# Altium schematic sheet LED_Matrix_Driver.SchDoc
size A3; SheetNumber: 4; SheetTotal: 4
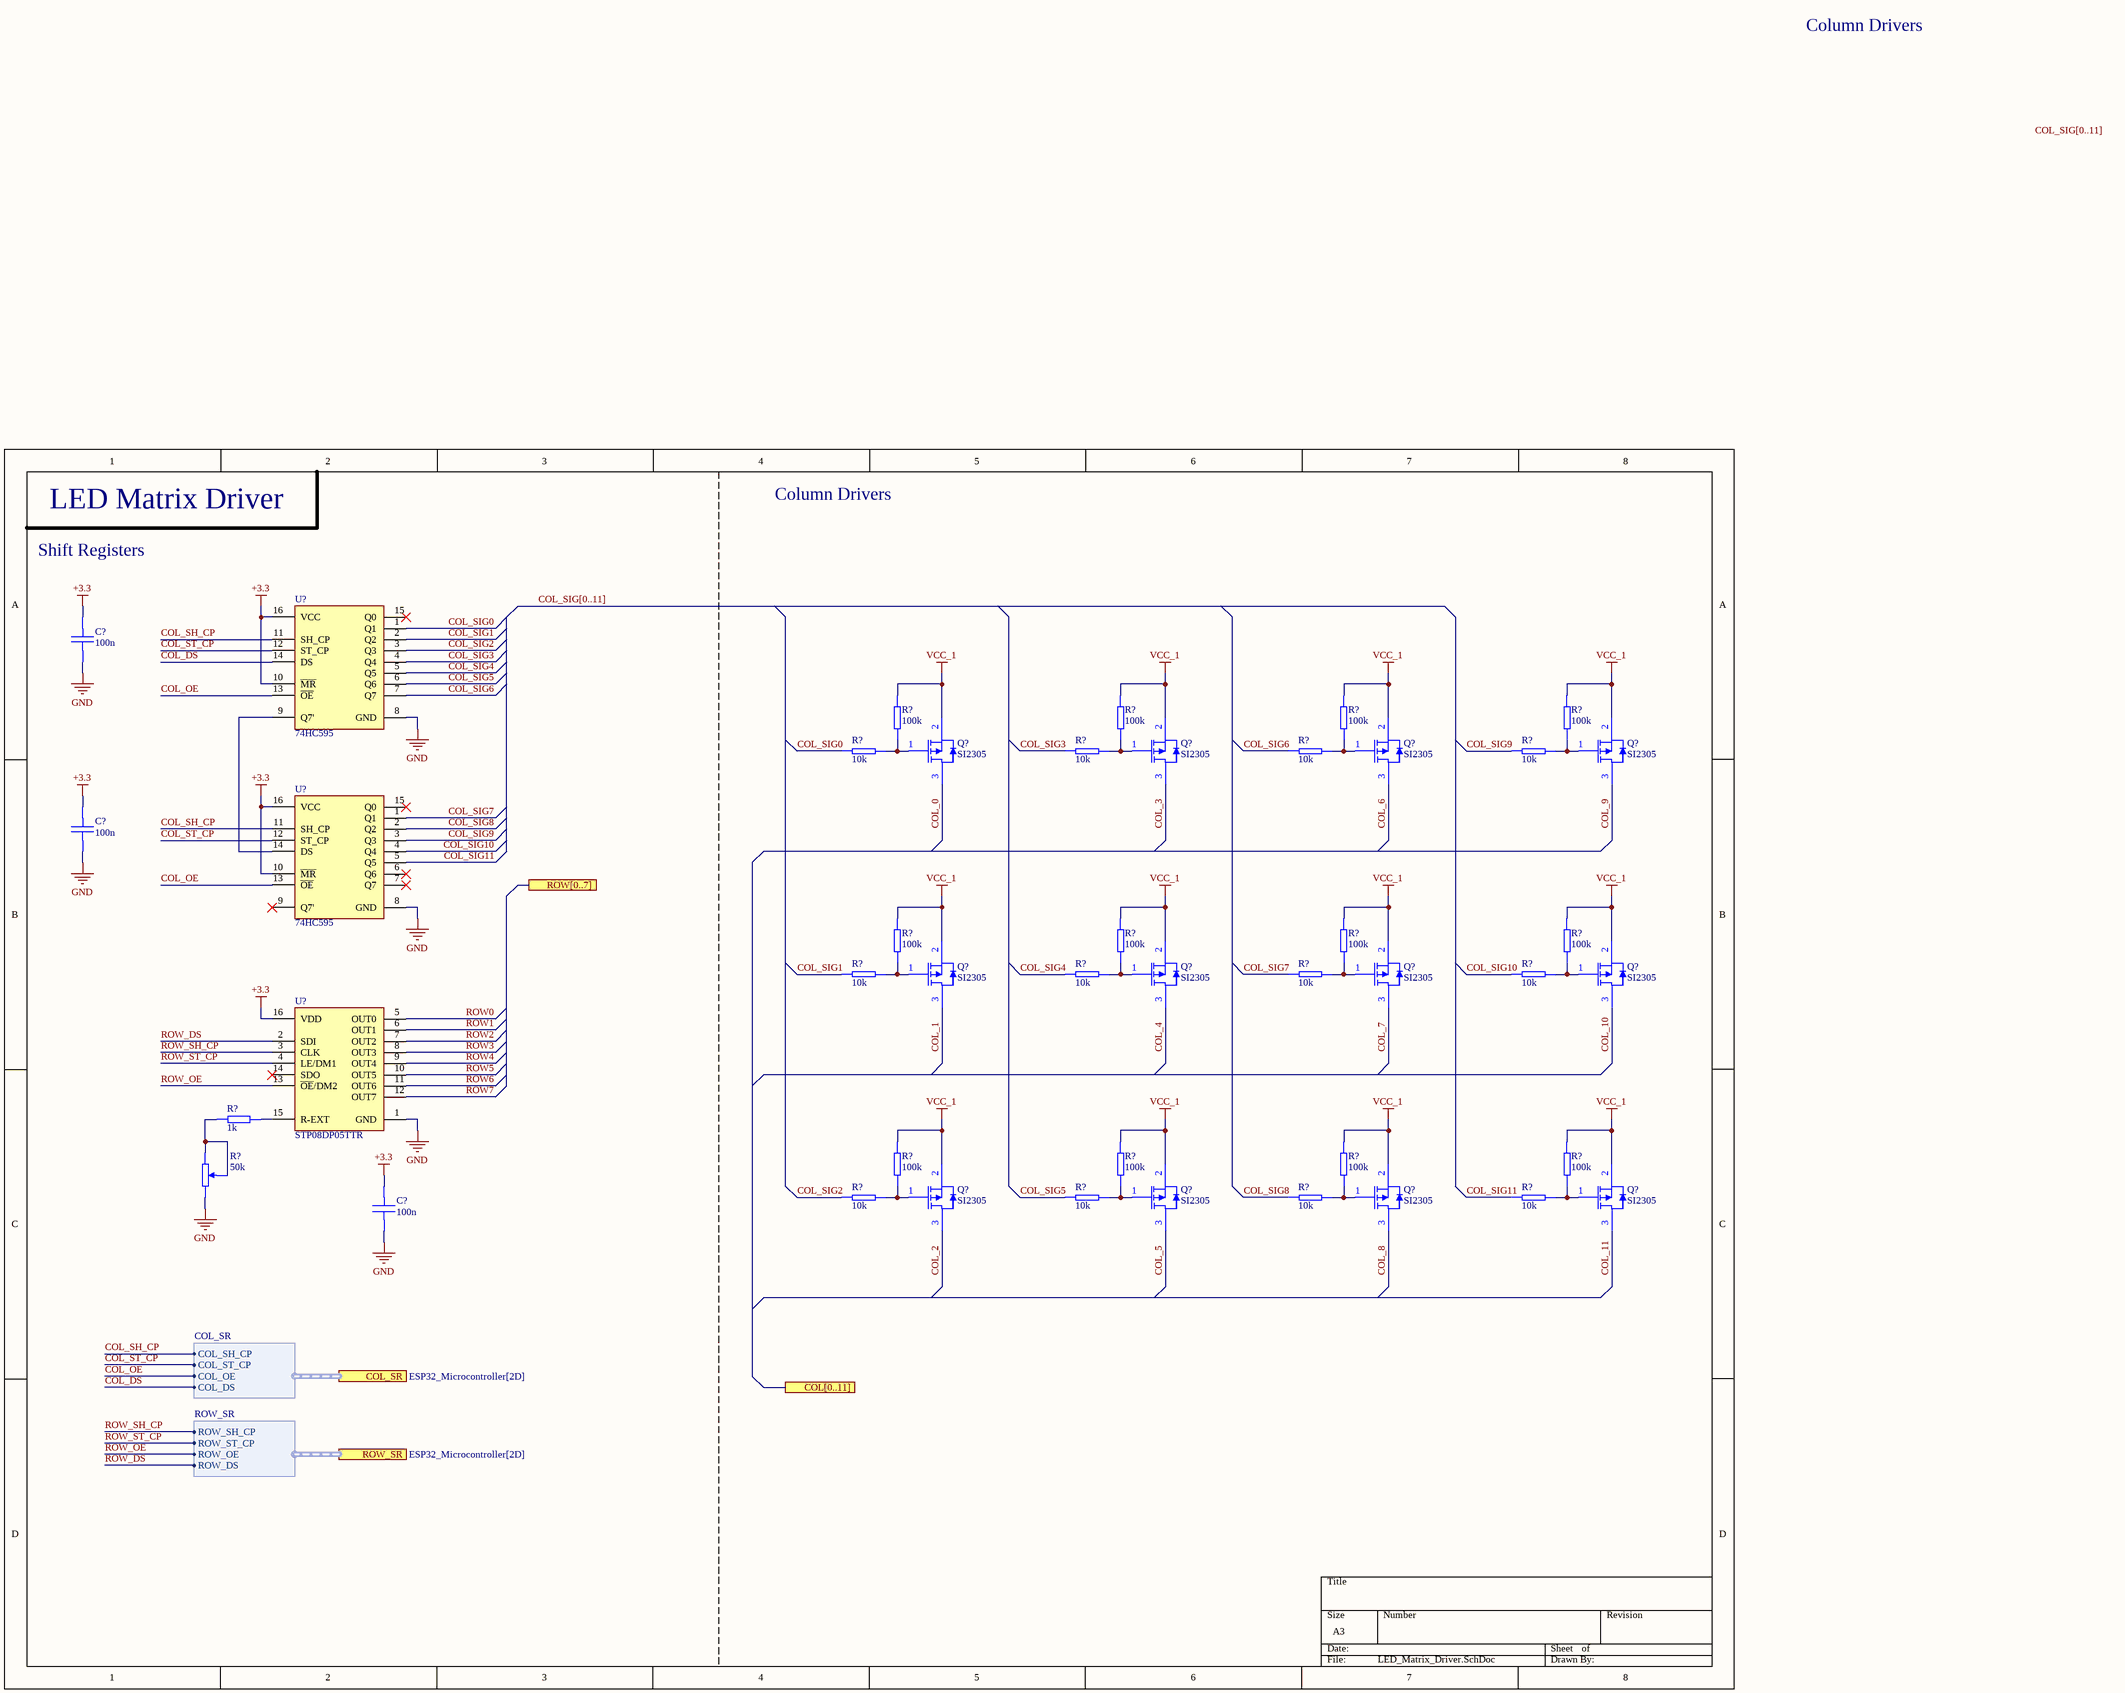
[diagram p0: LED_Matrix_Driver.SchDoc]

## Parts
(Parts that share a designator on the sheet are numbered #1, #2 ... from top to bottom, then left to right.)
C?#1  100n  [CAP0805]
C?#2  100n  [CAP0805]
C?#3  100n  [CAP0805]
Q?#1  SI2305  [SOT23]
Q?#2  SI2305  [SOT23]
Q?#3  SI2305  [SOT23]
Q?#4  SI2305  [SOT23]
Q?#5  SI2305  [SOT23]
Q?#6  SI2305  [SOT23]
Q?#7  SI2305  [SOT23]
Q?#8  SI2305  [SOT23]
Q?#9  SI2305  [SOT23]
Q?#10  SI2305  [SOT23]
Q?#11  SI2305  [SOT23]
Q?#12  SI2305  [SOT23]
R?#1  100k  [RESC0805]
R?#2  100k  [RESC0805]
R?#3  100k  [RESC0805]
R?#4  100k  [RESC0805]
R?#5  10k  [RESC0805]
R?#6  10k  [RESC0805]
R?#7  10k  [RESC0805]
R?#8  10k  [RESC0805]
R?#9  100k  [RESC0805]
R?#10  100k  [RESC0805]
R?#11  100k  [RESC0805]
R?#12  100k  [RESC0805]
R?#13  10k  [RESC0805]
R?#14  10k  [RESC0805]
R?#15  10k  [RESC0805]
R?#16  10k  [RESC0805]
R?#17  1k  [RESC0805]
R?#18  100k  [RESC0805]
R?#19  100k  [RESC0805]
R?#20  100k  [RESC0805]
R?#21  100k  [RESC0805]
R?#22  50k  [3339P1103LF]
R?#23  10k  [RESC0805]
R?#24  10k  [RESC0805]
R?#25  10k  [RESC0805]
R?#26  10k  [RESC0805]
U?#1  74HC595  [TSSOP16]
U?#2  74HC595  [TSSOP16]
U?#3  STP08DP05TTR  [TSSOP16]

## Ports
COL[0..11], COL_SR (harness COL_SR, see ESP32_Microcontroller[2D]), ROW[0..7], ROW_SR (harness ROW_SR, see ESP32_Microcontroller[2D])

## Harnesses
COL_SR: COL_SH_CP, COL_ST_CP, COL_OE, COL_DS
ROW_SR: ROW_SH_CP, ROW_ST_CP, ROW_OE, ROW_DS

## Nets
+3.3: C?#1.1 C?#2.1 C?#3.1 U?#1.10(~{MR}) U?#1.16(VCC) U?#2.10(~{MR}) U?#2.16(VCC) U?#3.16(VDD)
GND: C?#1.2 C?#2.2 C?#3.2 R?#22.3 U?#1.8(GND) U?#2.8(GND) U?#3.1(GND)
VCC_1: Q?#1.2(S) Q?#2.2(S) Q?#3.2(S) Q?#4.2(S) Q?#5.2(S) Q?#6.2(S) Q?#7.2(S) Q?#8.2(S) Q?#9.2(S) Q?#10.2(S) Q?#11.2(S) Q?#12.2(S) R?#1.1 R?#2.1 R?#3.1 R?#4.1 R?#9.1 R?#10.1 R?#11.1 R?#12.1 R?#18.1 R?#19.1 R?#20.1 R?#21.1
COL_0: Q?#1.3(D)
COL_1: Q?#5.3(D)
COL_2: Q?#9.3(D)
COL_3: Q?#2.3(D)
COL_4: Q?#6.3(D)
COL_5: Q?#10.3(D)
COL_6: Q?#3.3(D)
COL_7: Q?#7.3(D)
COL_8: Q?#11.3(D)
COL_9: Q?#4.3(D)
COL_10: Q?#8.3(D)
COL_11: Q?#12.3(D)
COL_DS: U?#1.14(DS) ; port COL_SR.COL_DS
COL_OE: U?#1.13(~{OE}) U?#2.13(~{OE}) ; port COL_SR.COL_OE
COL_SH_CP: U?#1.11(SH_CP) U?#2.11(SH_CP) ; port COL_SR.COL_SH_CP
COL_SIG0: R?#5.1 U?#1.1(Q1)
COL_SIG1: R?#13.1 U?#1.2(Q2)
COL_SIG2: R?#23.1 U?#1.3(Q3)
COL_SIG3: R?#6.1 U?#1.4(Q4)
COL_SIG4: R?#14.1 U?#1.5(Q5)
COL_SIG5: R?#24.1 U?#1.6(Q6)
COL_SIG6: R?#7.1 U?#1.7(Q7)
COL_SIG7: R?#15.1 U?#2.1(Q1)
COL_SIG8: R?#25.1 U?#2.2(Q2)
COL_SIG9: R?#8.1 U?#2.3(Q3)
COL_SIG10: R?#16.1 U?#2.4(Q4)
COL_SIG11: R?#26.1 U?#2.5(Q5)
COL_ST_CP: U?#1.12(ST_CP) U?#2.12(ST_CP) ; port COL_SR.COL_ST_CP
ROW0: U?#3.5(OUT0)
ROW1: U?#3.6(OUT1)
ROW2: U?#3.7(OUT2)
ROW3: U?#3.8(OUT3)
ROW4: U?#3.9(OUT4)
ROW5: U?#3.10(OUT5)
ROW6: U?#3.11(OUT6)
ROW7: U?#3.12(OUT7)
ROW_DS: U?#3.2(SDI) ; port ROW_SR.ROW_DS
ROW_OE: U?#3.13(~{OE}/DM2) ; port ROW_SR.ROW_OE
ROW_SH_CP: U?#3.3(CLK) ; port ROW_SR.ROW_SH_CP
ROW_ST_CP: U?#3.4(LE/DM1) ; port ROW_SR.ROW_ST_CP
NetQ?#1_1: Q?#1.1(G) R?#1.2 R?#5.2
NetQ?#2_1: Q?#2.1(G) R?#2.2 R?#6.2
NetQ?#3_1: Q?#3.1(G) R?#3.2 R?#7.2
NetQ?#4_1: Q?#4.1(G) R?#4.2 R?#8.2
NetQ?#5_1: Q?#5.1(G) R?#9.2 R?#13.2
NetQ?#6_1: Q?#6.1(G) R?#10.2 R?#14.2
NetQ?#7_1: Q?#7.1(G) R?#11.2 R?#15.2
NetQ?#8_1: Q?#8.1(G) R?#12.2 R?#16.2
NetQ?#9_1: Q?#9.1(G) R?#18.2 R?#23.2
NetQ?#10_1: Q?#10.1(G) R?#19.2 R?#24.2
NetQ?#11_1: Q?#11.1(G) R?#20.2 R?#25.2
NetQ?#12_1: Q?#12.1(G) R?#21.2 R?#26.2
NetR?#17_1: R?#17.1 U?#3.15(R-EXT)
NetR?#17_2: R?#17.2 R?#22.1 R?#22.2
NetU?#1_9: U?#1.9(Q7') U?#2.14(DS)

Not connected (* = marked no-connect by the designer): U?#1 15(Q0)*; U?#2 6(Q6)* 7(Q7)* 9(Q7')* 15(Q0)*; U?#3 14(SDO)*

## Buses and harness runs
bus COL_SIG[0..11]

## Notes on the sheet
- Column Drivers
- LED Matrix Driver
- Shift Registers
- Labels drawn without touching a wire or pin: COL_SIG[0..11]

## Library data of the parts
C?#1-C?#3 = Capacitor - Non Polarized: Non Polarized Capacitor
Q?#1-Q?#12 = SI2305: General Purpose P-Channel MOSFET; ComponentLink1Description: Datasheet; ComponentLink1URL: https://www.vishay.com/docs/64847/si2305cd.pdf
R?#1-R?#21 R?#23-R?#26 = Resistor
R?#22 = Potentiometer: Potentionmeter
U?#1 U?#2 = 74HC595: Shift Register
U?#3 = STP08DP05TTR: LED Driver; Manufacturer_Name: STMicroelectronics; Datasheet Link: https://componentsearchengine.com/Datasheets/2/STP08DP05TTR.pdf; Height: 1.2mm; Manufacturer_Part_Number: STP08DP05TTR; Mouser Part Number: 511-STP08DP05TTR; Mouser Price/Stock: https://www.mouser.co.uk/ProductDetail/STMicroelectronics/STP08DP05TTR?qs=xgiOkRdDJ0m7T%2FaY25F5vQ%3D%3D; Arrow Part Number: STP08DP05TTR; Arrow Price/Stock: https://www.arrow.com/en/products/stp08dp05ttr/stmicroelectronics?region=nac